# EAGLE design OSO-MISC-20-008 Trinket Adapter (EAGLE 9.4.2)
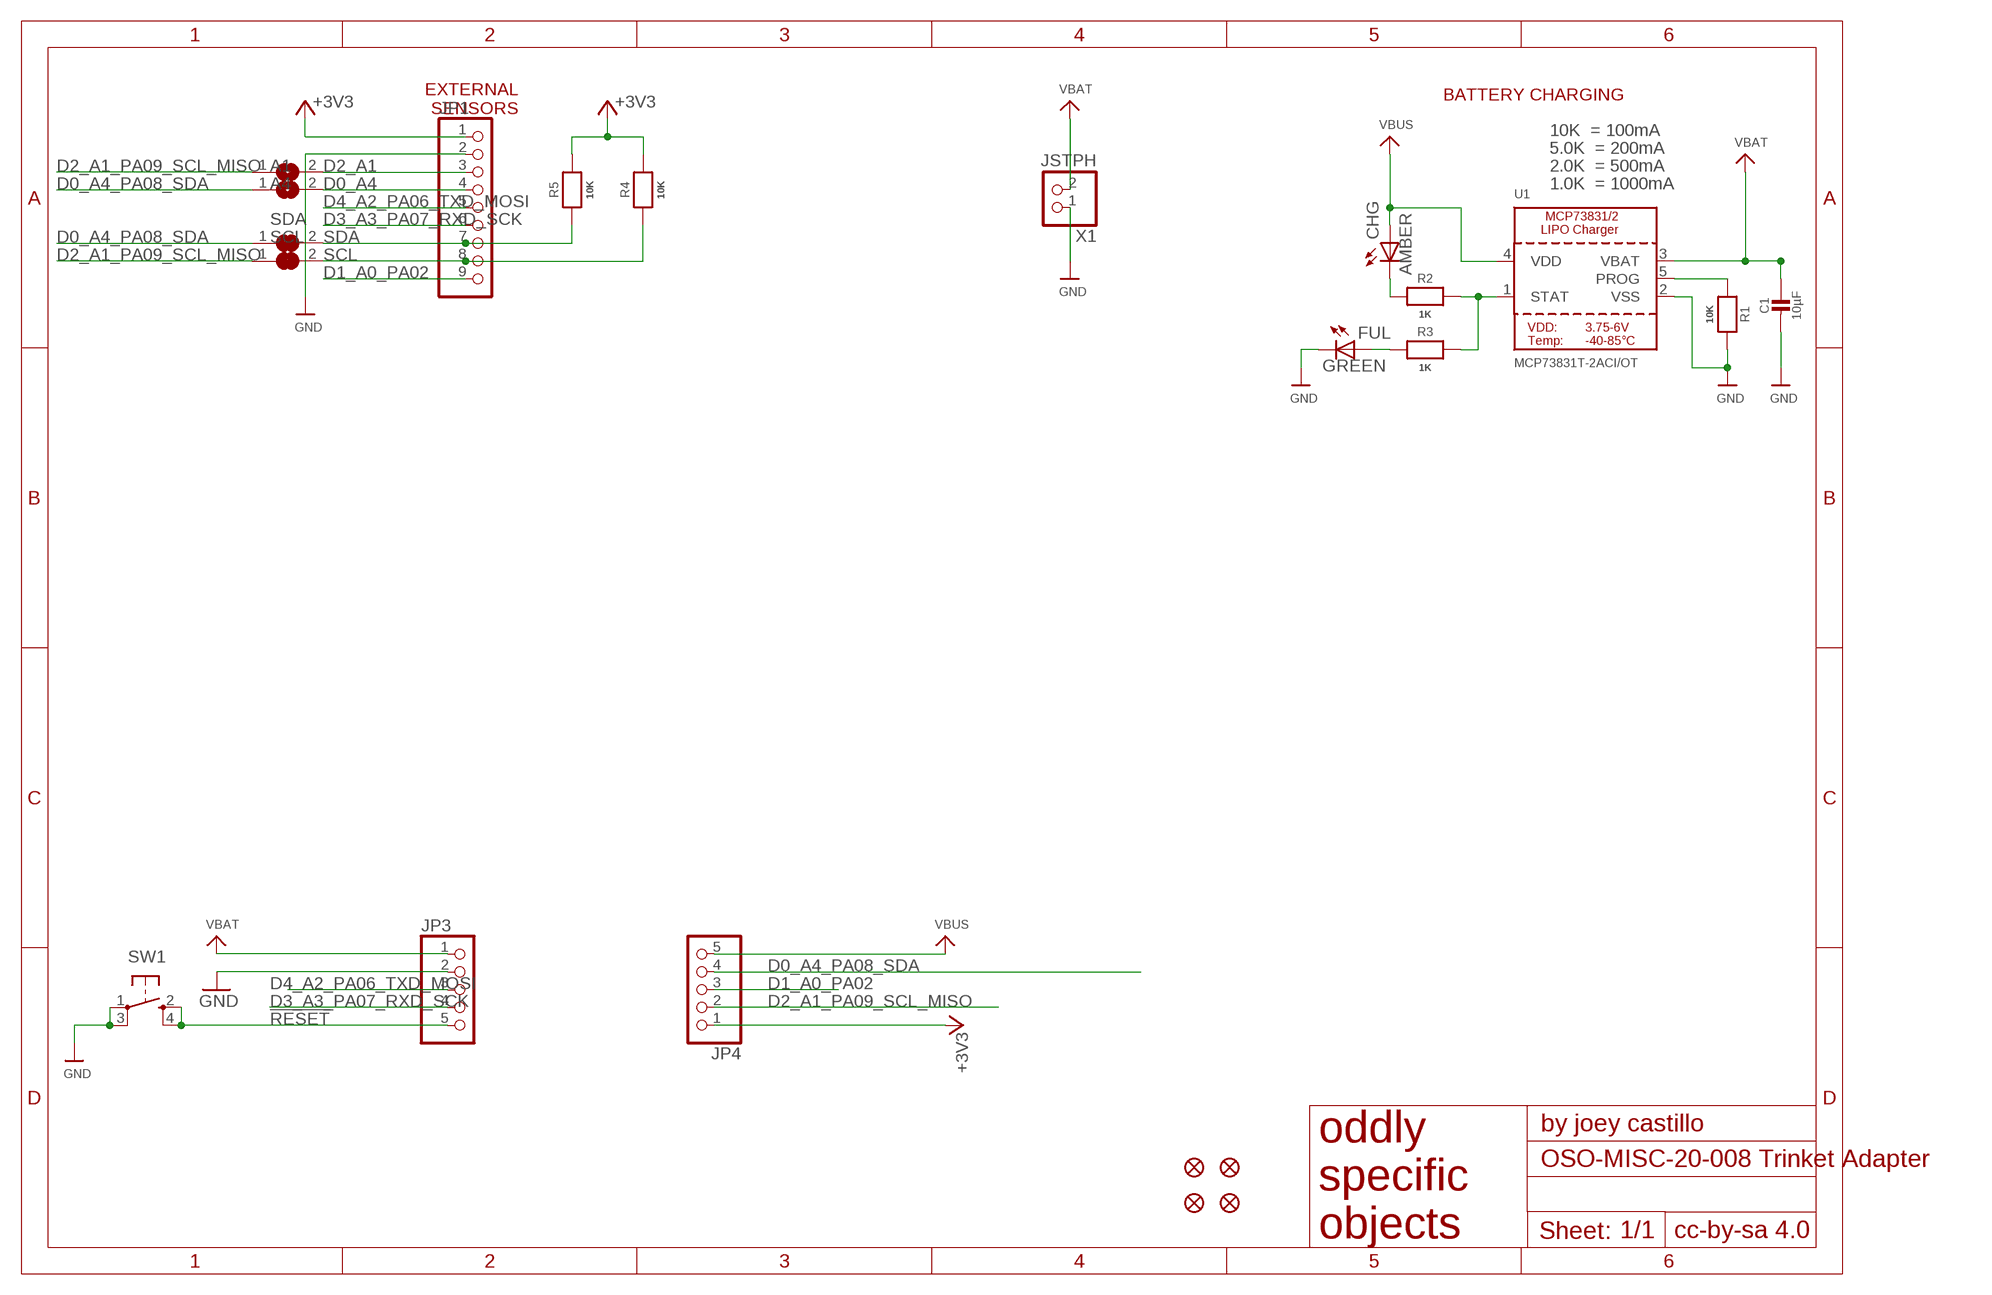
[diagram p0: schematic, sheet 1]

## Parts
A1  SOLDERJUMPERREFLOW_NOPASTE  [SOLDERJUMPER_REFLOW_NOPASTE]
A4  SOLDERJUMPERREFLOW_NOPASTE  [SOLDERJUMPER_REFLOW_NOPASTE]
C1  10µF  CAP_CERAMIC0805-NOOUTLINE  [0805-NO]
CHG  AMBER  LEDCHIPLED_0805  [CHIPLED_0805]
FID1  FIDUCIAL_1MM  [FIDUCIAL_1MM]
FID2  FIDUCIAL_1MM  [FIDUCIAL_1MM]
FID3  FIDUCIAL_1MM  [FIDUCIAL_1MM]
FID4  FIDUCIAL_1MM  [FIDUCIAL_1MM]
FUL  GREEN  LEDCHIPLED_0805  [CHIPLED_0805]
JP1  HEADER-1X9_JSTSH  [JST_SH9]
JP3  HEADER-1X576MIL  [1X05_ROUND_76]
JP4  HEADER-1X576MIL  [1X05_ROUND_76]
R1  10K  RESISTOR0805_NOOUTLINE  [0805-NO]
R2  1K  RESISTOR0805_NOOUTLINE  [0805-NO]
R3  1K  RESISTOR0805_NOOUTLINE  [0805-NO]
R4  10K  RESISTOR0805_NOOUTLINE  [0805-NO]
R5  10K  RESISTOR0805_NOOUTLINE  [0805-NO]
SCL  MICROBUILDER_SOLDERJUMPER_CLOSED  [MICROBUILDER_SOLDERJUMPER_CLOSEDWIRE]
SDA  MICROBUILDER_SOLDERJUMPER_CLOSED  [MICROBUILDER_SOLDERJUMPER_CLOSEDWIRE]
SW1  SPST_TACT-KMR2  [KMR2]
U1  MCP73831T-2ACI/OT  MCP73831/2  [SOT23-5]
X1  JSTPH  CON_JST_PH_2PIN  [JSTPH2]

## Nets
!RESET: JP3.5 SW1.2(S) SW1.4(S1)
+3V3 [power]: JP1.1 JP4.1 R4.2 R5.2
D0_A4: A4.2 JP1.4
D0_A4_PA08_SDA: A4.1 JP4.4 SDA.1
D1_A0_PA02: JP1.9 JP4.3
D2_A1: A1.2 JP1.3
D2_A1_PA09_SCL_MISO: A1.1 JP4.2 SCL.1
D3_A3_PA07_RXD_SCK: JP1.6 JP3.4
D4_A2_PA06_TXD_MOSI: JP1.5 JP3.3
GND: C1.2 FUL.C JP1.2 JP3.2 R1.2 SW1.1(P) SW1.3(P1) U1.2(VSS) X1.1
N$4: CHG.C R2.1
N$9: FUL.A R3.1
PROG: R1.1 U1.5(PROG)
SCL: JP1.8 R4.1 SCL.2
SDA: JP1.7 R5.1 SDA.2
STAT: R2.2 R3.2 U1.1(STAT)
VBAT: C1.1 JP3.1 U1.3(VBAT) X1.2
VBUS: CHG.A JP4.5 U1.4(VDD)

## Notes on the sheet
- EXTERNAL
  SENSORS
- BATTERY CHARGING
- 10K  = 100mA
- 5.0K  = 200mA
- 2.0K  = 500mA
- 1.0K  = 1000mA

## Library data of the parts
A1 A4 = microbuilder:SOLDERJUMPER: SMD Solder JUMPER Solder the two pads together to create a connection, or remove the solder to break it. REFLOW - Use this footprint for solder paste and reflow ovens. WAVE - Use this footprint for hand-soldering (larger pads). CLOSED - Has a trace between the two pads to ensure it is closed by default. The trace needs to be cut to disable the jumper, and can be closed again by creating a solder bridge between the two pads.
C1 = microbuilder:CAP_CERAMIC: Ceramic Capacitors For new designs, use the packages preceded by an '_' character since they are more reliable: The following footprints should be used on most boards: _0402 - Standard footprint for regular board layouts _0603 - Standard footprint for regular board layouts _0805 - Standard footprint for regular board layouts _1206 - Standard footprint for regular board layouts For extremely tight-pitch boards where space is at a premium, the following 'micro-pitch' footprints can be used (smaller pads, no silkscreen outline, etc.): _0402MP - Micro-pitch footprint for very dense/compact boards _0603MP - Micro-pitch footprint for very dense/compact boards _0805MP - Micro-pitch footprint for very dense/compact boards _1206MP - Micro-pitch footprint for very dense/compact boards
CHG FUL = adafruit:LED: LED OSRAM: - CHIPLED LG R971, LG N971, LY N971, LG Q971, LY Q971, LO R971, LY R971 LH N974, LH R974 LS Q976, LO Q976, LY Q976 LO Q996 - Hyper CHIPLED LW Q18S LB Q993, LB Q99A, LB R99A - SideLED LS A670, LO A670, LY A670, LG A670, LP A670 LB A673, LV A673, LT A673, LW A673 LH A674 LY A675 LS A676, LA A676, LO A676, LY A676, LW A676 LS A679, LY A679, LG A679 - Hyper Micro SIDELED® LS Y876, LA Y876, LO Y876, LY Y876 LT Y87S - SmartLED LW L88C, LW L88S LB L89C, LB L89S, LG L890 LS L89K, LO L89K, LY L89K LS L896, LA L896, LO L896, LY L896 - TOPLED LS T670, LO T670, LY T670, LG T670, LP T670 LSG T670, LSP T670, LSY T670, LOP T670, LYG T670 LG T671, LOG T671, LSG T671 LB T673, LV T673, LT T673, LW T673 LH T674 LS T676, LA T676, LO T676, LY T676, LB T676, LH T676, LSB T676, LW T676 LB T67C, LV T67C, LT T67C, LS T67K, LO T67K, LY T67K, LW E67C LS E67B, LA E67B, LO E67B, LY E67B, LB E67C, LV E67C, LT E67C LW T67C LS T679, LY T679, LG T679 LS T770, LO T770, LY T770, LG T770, LP T770 LB T773, LV T773, LT T773, LW T773 LH T774 LS E675, LA E675, LY E675, LS T675 LS T776, LA T776, LO T776, LY T776, LB T776 LHGB T686 LT T68C, LB T68C - Hyper Mini TOPLED® LB M676 - Mini TOPLED Santana® LG M470 LS M47K, LO M47K, LY M47K Source: http://www.osram.convergy.de/
FID1-FID4 = microbuilder:FIDUCIAL: Fiducial Alignment Points Various fiducial points for machine vision alignment.; BOM: EXCLUDE
JP1 = microbuilder:HEADER-1X9: PIN HEADER
JP3 JP4 = microbuilder:HEADER-1X5: PIN HEADER
R1-R5 = microbuilder:RESISTOR: Resistors For new designs, use the packages preceded by an '_' character since they are more reliable: The following footprints should be used on most boards: _0402 - Standard footprint for regular board layouts _0603 - Standard footprint for regular board layouts _0805 - Standard footprint for regular board layouts _1206 - Standard footprint for regular board layouts For extremely tight-pitch boards where space is at a premium, the following 'micro-pitch' footprints can be used (smaller pads, no silkscreen outline, etc.): _0402MP - Micro-pitch footprint for very dense/compact boards _0603MP - Micro-pitch footprint for very dense/compact boards _0805MP - Micro-pitch footprint for very dense/compact boards _1206MP - Micro-pitch footprint for very dense/compact boards
SCL SDA = My Stuff:MICROBUILDER_SOLDERJUMPER_CLOSED: Solder Jumper - Closed These solder jumpers are closed by default CLOSEDWIRE - 10 mil trace between pads that can be cut and resoldered later CLOSEDPERM - 63 mil trace between pads for a permanent connection (used to 'bridge' two signals, a shameless hack for Eagle). Can double as a test point as well (no cream layer)
SW1 = adafruit:SPST_TACT: SMT 6mm switch, EVQQ2 series http://www.ladyada.net/library/eagle
U1 = microbuilder:MCP73831/2: MCP73831/2 LIPO Charger VDD: 3.75 - 6V Temp -40 - 85°C Programmable Charge Rate: 15-500mA NOTE: STAT is a tri-state logic output on the MCP73831 and an open-drain output on the MCP73832. SOT23-5 with 4.2V output and tri-state logic on STAT = MCP73831T-2ACI/OT
X1 = microbuilder:CON_JST_PH_2PIN: JST 2-Pin Right-Angle Connector PH-Series - 4UConnector: 17311 SH-Series - 4UConnector: 07278

## Net classes
1 power: width 0.305 mm
2 gnd: width 0.254 mm, drill 0.254 mm

## Board
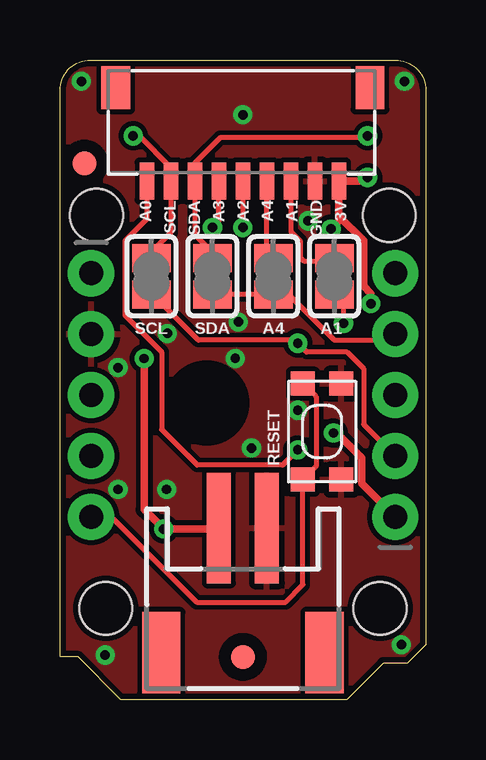
[diagram p1: board, top side]
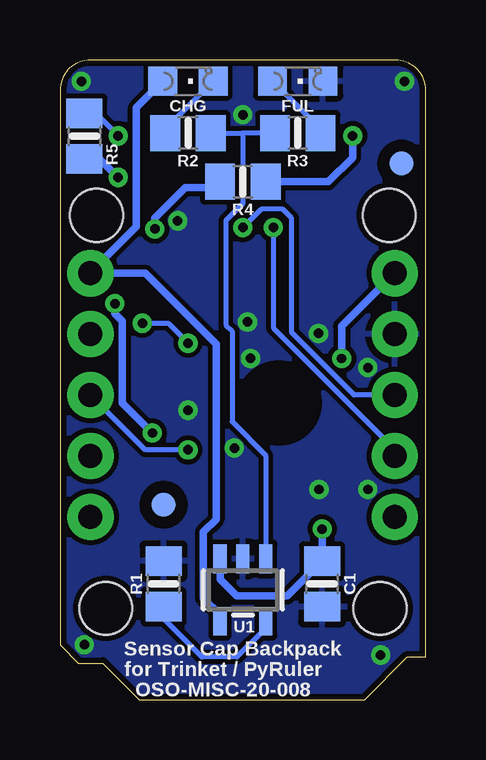
[diagram p2: board, bottom side, seen from below]

Size 15.24 x 26.67 mm. Coordinates in mm from the lower left corner, seen from the top.
Outline: 15.24,25.4 15.24,2.29 14.48,1.52 13.46,1.52 11.94,0 2.54,0 0.76,1.78 0,1.78 0,25.4 arc-90 1.27,26.67 13.97,26.67 arc-90 15.24,25.4
Copper layers (1*16): Top 0.035mm / dielectric 1.5mm / Bottom 0.035mm
Design rules "adafruit *": minimum track width 8mil, minimum drill 15.5mil, track to track 8mil, track to pad 8mil, pad to pad 8mil, via to via 8mil, smd to smd 8mil, copper to edge 10mil, drill to drill 8mil, minimum pad ring 10mil, minimum via ring 8mil, stop-mask expansion 2mil, vias tented up to drill 20mil, thermal gap 10mil
Holes 2.2 mm at 1.52,20.19 13.72,20.19 1.91,3.81 13.34,3.81
tRestrict: area 5.6,11.9 to 6.6,12.9
bRestrict: area 5.6,11.9 to 6.6,12.9

### Footprints (pad centres in the part's own frame; a part is rotated, then mirrored left to right if it is on the bottom)
SOLDERJUMPER_REFLOW_NOPASTE = smd 1.168 x 1.6: 1 -0.762,0; 2 0.762,0
0805-NO = smd 1.24 x 1.5: 1 -0.95,0; 2 0.95,0
CHIPLED_0805 = smd 1.2 x 1.2: A 0,-1.05; C 0,1.05
FIDUCIAL_1MM = smd 1 x 1: 1 0,0
JST_SH9 = smd 0.6 x 1.55: 1 -4,2.514; 2 -3,2.514; 3 -2,2.514; 4 -1,2.514; 5 0,2.514; 6 1,2.514; 7 2,2.514; 8 3,2.514; 9 4,2.514 | smd 1.2 x 1.8: MT1 -5.3,-1.386; MT2 5.3,-1.386
1X05_ROUND_76 = drill 1 pad 1.93: 1 -5.08,0; 2 -2.54,0; 3 0,0; 4 2.54,0; 5 5.08,0
MICROBUILDER_SOLDERJUMPER_CLOSEDWIRE = smd 1.168 x 1.6: 1 -0.762,0; 2 0.762,0 | smd 0.635 x 0.203: WIRE 0,0
KMR2 = smd 1 x 1: 1 2,0.8; 2 2,-0.8; 3 -2,0.8; 4 -2,-0.8
SOT23-5 = smd 0.55 x 1.2: 1 -0.95,-1.3; 2 0,-1.3; 3 0.95,-1.3; 4 0.95,1.3; 5 -0.95,1.3
JSTPH2 = smd 1 x 4.6: 1 -1,-3.7; 2 1,-3.7 | smd 1.6 x 3.4: NC1 -3.4,1.5; NC2 3.4,1.5

### Placement (x,y rotation side)
A1  11.43,17.65 90 top
A4  8.89,17.65 90 top
C1  4.32,4.83 270 bottom
CHG  9.91,25.78 270 bottom
FID1  1.02,22.35 0 top
FID2  7.62,1.78 0 top
FID3  1.02,22.35 0 bottom
FID4  10.92,8.13 0 bottom
FUL  5.33,25.78 270 bottom
JP1  7.62,24.13 180 top
JP3  1.3,12.7 270 top
JP4  13.97,12.7 90 top
R1  10.92,4.83 90 bottom
R2  9.91,23.62 0 bottom
R3  5.33,23.62 180 bottom
R4  7.62,21.59 180 bottom
R5  14.22,23.5 270 bottom
SCL  3.81,17.65 90 top
SDA  6.35,17.65 90 top
SW1  10.92,11.18 270 top
U1  7.62,4.57 180 bottom
X1  7.62,3.45 180 top

### Tracks (layer width: path | path; a pad name or v marks a point on that pad's centre or on a via)
!RESET
  Top 0.203: SW1.4 10.67,12.63 10.67,9.72 SW1.2 10.12,4.79 9.4,4.06 5.69,4.06 2.13,7.62 JP3.5
+3V3  (via drill 0.39)
  Top 0.305: v12.95,16.51 12.95,16.93 12.65,17.23 12.65,19.13 11.62,20.16 | v11.39,11.12 11.54,11.12 12.58,10.08 12.58,9.01 JP4.1 | 11.62,20.16 JP1.1 12.66,21.62 v12.81,21.77 | v11.29,19.62 11.62,19.95 11.62,20.16
  Bottom 0.305: v12.95,16.51 12.95,16.09 12.65,15.79 12.65,12.38 v11.39,11.12 | R5.2 13.59,22.55 v12.81,21.77 | v11.29,19.62 11.29,20.08 10.02,21.36 8.8,21.36 R4.2
D0_A4
  Top 0.203: JP1.4 8.62,18.69 A4.2
D0_A4_PA08_SDA
  Top 0.203: JP4.4 13.72,14.99 11.43,14.99 9.53,16.89 A4.1 SDA.1
D1_A0_PA02  (via drill 0.39)
  Top 0.203: JP1.9 3.62,20.04 2.71,19.12 2.71,16.03 4.24,14.5 4.24,11.26 5.71,9.78 9.27,9.78 v9.91,10.41
  Bottom 0.203: JP4.3 11.68,10.41 v9.91,10.41
D2_A1
  Top 0.203: JP1.3 9.62,19.51 10.02,19.11 10.02,18.43 10.16,18.29 11.3,18.29 A1.2
D2_A1_PA09_SCL_MISO  (via drill 0.39)
  Top 0.203: SCL.1 3.86,16.89 5.77,14.99 9.78,14.99 v9.91,14.86 10.28,14.49 11.97,14.49 12.65,13.8 12.65,11.48 JP4.2 | A1.1 11.81,16.51 v11.81,15.69
  Bottom 0.203: v11.81,15.69 10.74,15.69 v9.91,14.86
D3_A3_PA07_RXD_SCK  (via drill 0.39)
  Top 0.203: v6.35,19.69 6.62,19.96 JP1.6
  Bottom 0.203: v6.35,19.69 6.35,15.49 1.29,10.44 JP3.4
D4_A2_PA06_TXD_MOSI  (via drill 0.39)
  Top 0.203: JP1.5 v7.62,19.69
  Bottom 0.203: v7.62,19.69 6.86,20.45 5.97,20.45 5.59,20.07 5.59,15.31 2.98,12.7 JP3.3
GND  (via drill 0.39)
  other vias: 9.91,12.07 7.3,14.22 0.89,25.78 2.41,13.84 2.41,8.76 4.45,8.76 4.47,15.27 10.34,19.96 7.62,24.38 14.22,2.29 7.43,15.75 14.35,25.78 7.98,10.49 1.88,1.85
  pour Bottom: 0,26.67 0,0 15.24,0 15.24,26.67
  pour Top: 0,26.67 0,0 15.24,0 15.24,26.67
N$4
  Bottom 0.203: CHG.C 10.86,23.78 R2.1
N$9
  Bottom 0.203: R3.1 4.38,23.78 FUL.A
PROG
  Bottom 0.203: U1.5 6.67,2.98 7.87,1.78 9.33,1.78 10.92,3.37 R1.1
SCL  (via drill 0.39)
  Top 0.203: SCL.2 3.81,18.67 4.62,19.48 JP1.8 4.62,22.19 3.3,23.51 v3.05,23.51
  Bottom 0.305: R4.1 4.06,21.59 3.05,22.61 v3.05,23.51
SDA  (via drill 0.39)
  Top 0.203: SDA.2 6.35,18.67 5.62,19.4 JP1.7 5.62,22.38 6.67,23.43 12.73,23.43 v12.81,23.51
  Bottom 0.203: v12.81,23.51 13.75,24.45 R5.1
STAT
  Bottom 0.203: 7.62,23.62 7.62,20.68 8.32,19.98 8.32,15.62 8.07,15.37 8.07,11.59 6.67,10.19 U1.1 | R3.2 7.62,23.62 | R2.2 7.62,23.62
VBAT  (via drill 0.39)
  Top 0.305: v3.51,14.22 3.51,7.92 v4.32,7.11 6.58,7.11 X1.2
  Bottom 0.305: v4.32,7.11 C1.1 5.78,4.32 7.87,4.32 8.57,5.01 U1.3 | JP3.1 3.51,15.57 v3.51,14.22
VBUS
  Bottom 0.305: U1.4 8.57,3.53 9.27,4.23 9.27,6.99 8.74,7.52 8.74,14.83 11.68,17.78 JP4.5 13.59,18.16 13.62,18.16 12.06,19.72 12.06,24.68 CHG.A

### Text on the board
tPlace: A0 | SCL | SDA | A3 | A2 | A4 | A1 | GND | 3V | RESET
bPlace: Sensor Cap Backpack / for Trinket / PyRuler / OSO-MISC-20-008
tDocu: D0/A4/SDA | D4/A2/RXD/MOSI | D1/A0/VOUT | D3/A3/TXD/SCK | D2/A1/SCL/MISO